# Altium schematic sheet MelansonTech Isolated Shunt Amplifier.SchDoc
size C
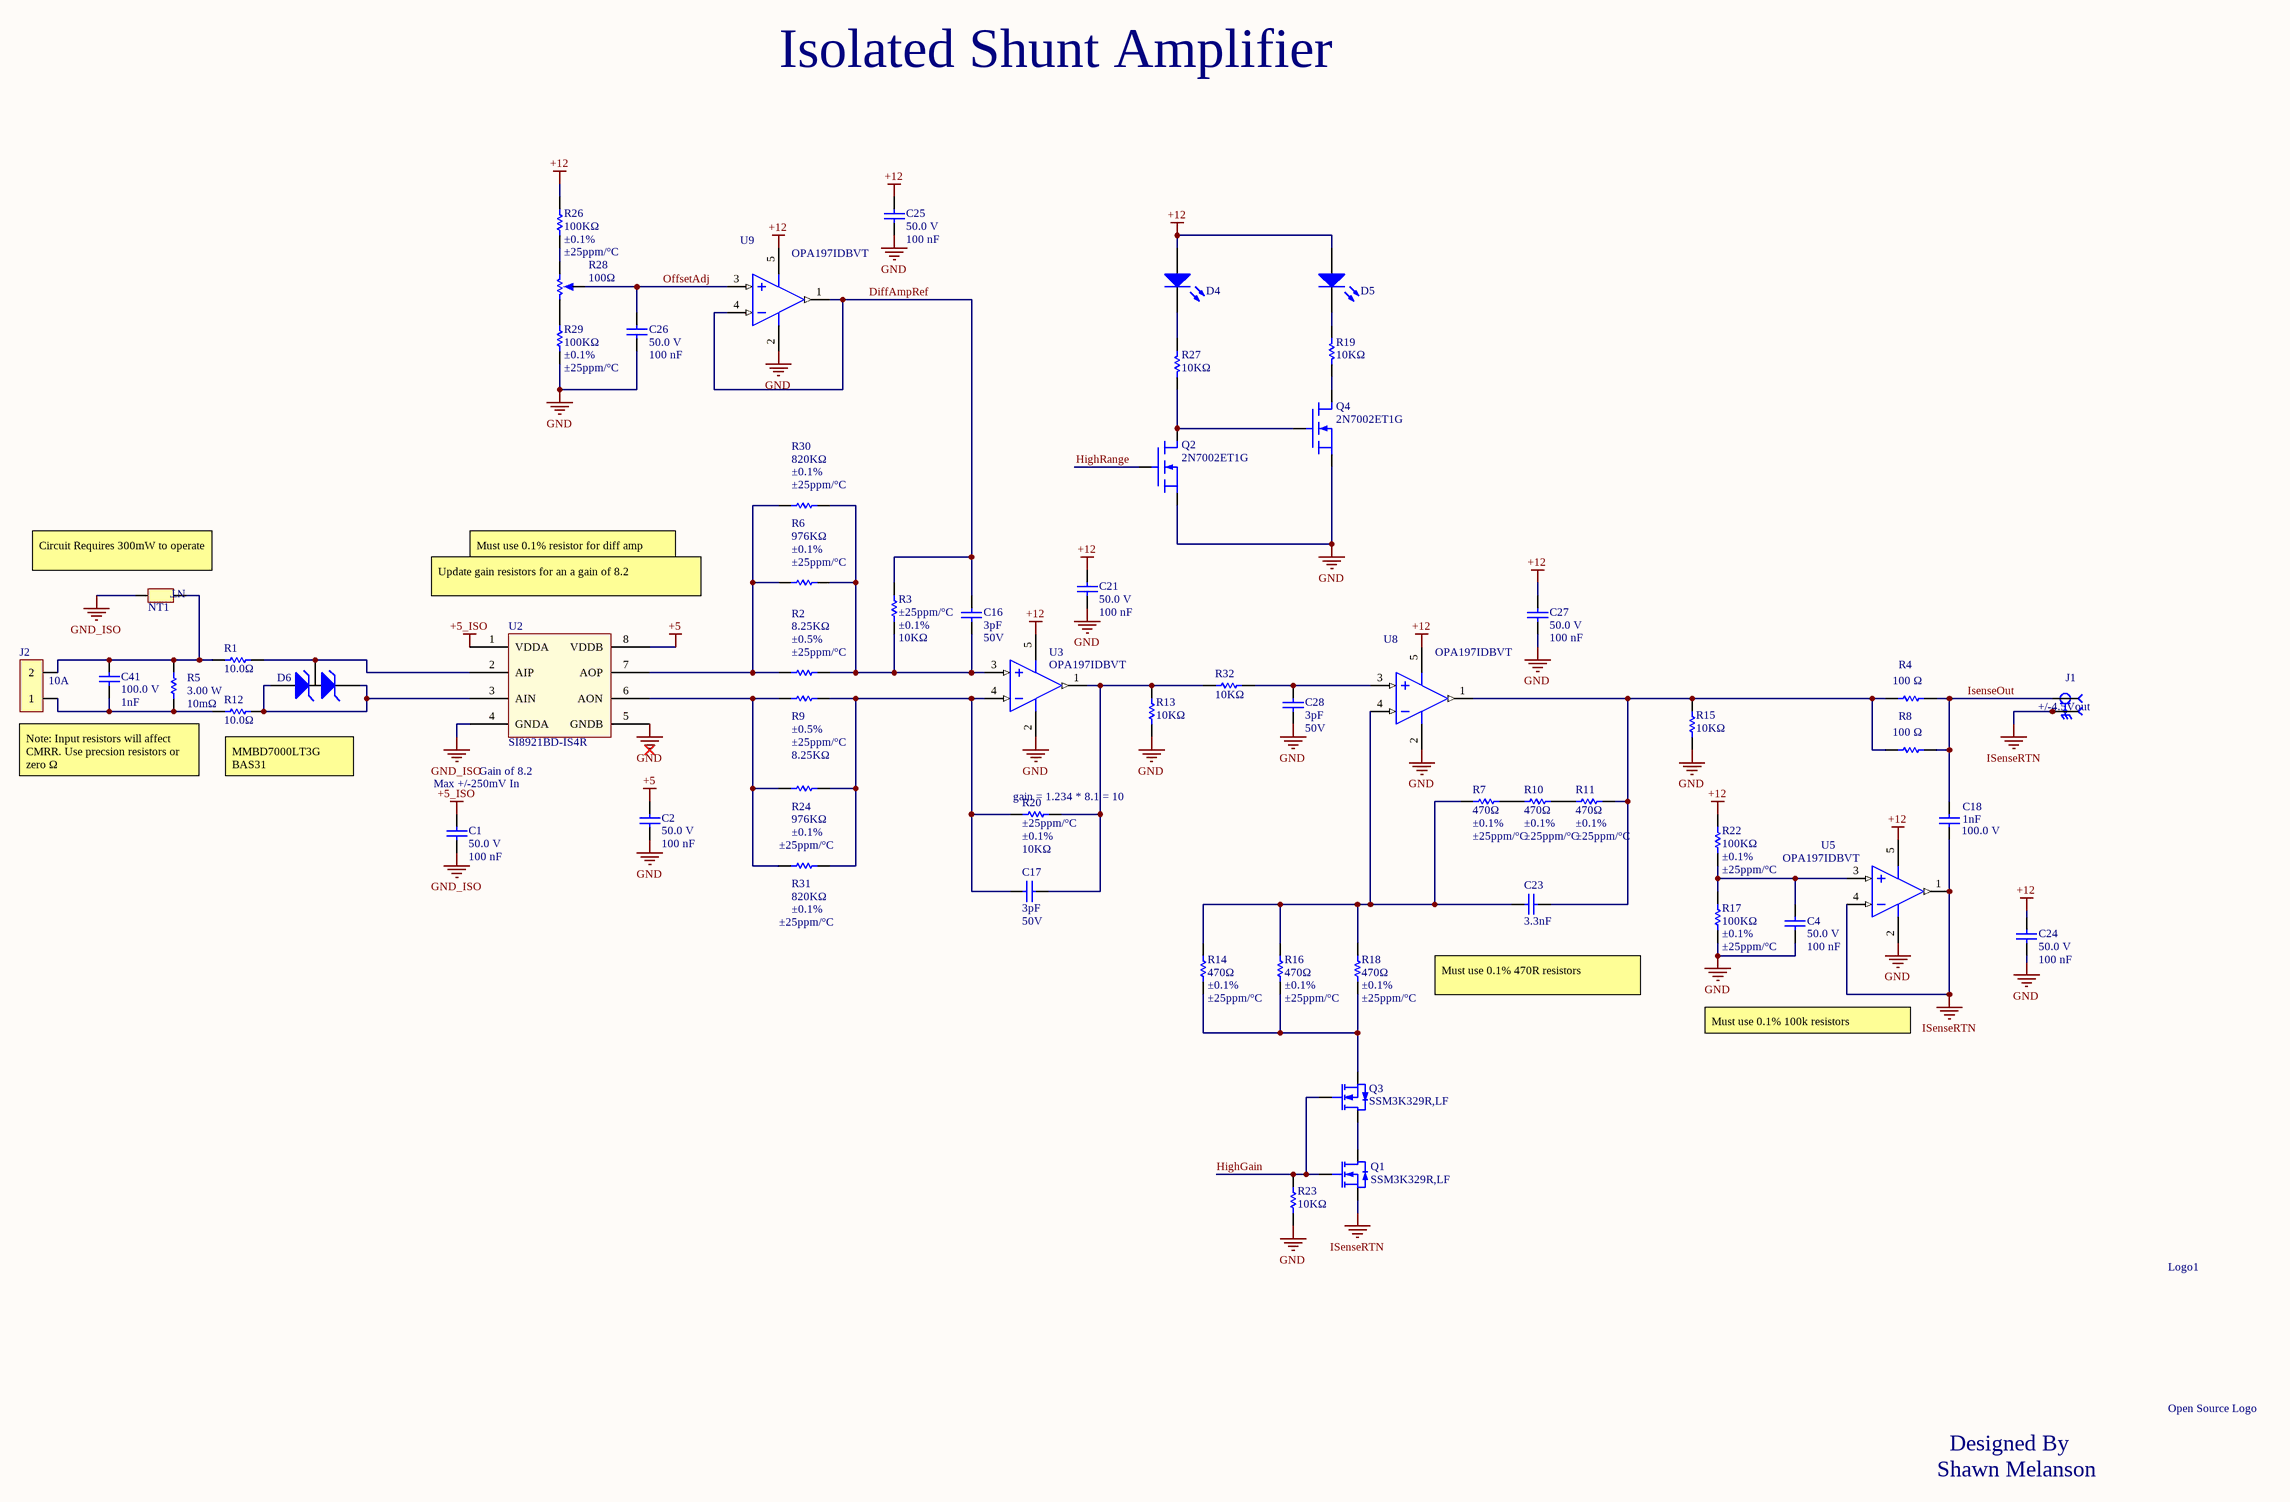
[diagram p0: MelansonTech Isolated Shunt Amplifier.SchDoc]

## Parts
C1  Voltage Rating (DC): 50.0 V  Capacitance: 100 nF  [CAP, 0805, HD]  (hidden comment: CC0805KRX7R9BB104)
C2  Voltage Rating (DC): 50.0 V  Capacitance: 100 nF  [CAP, 0805, HD]  (hidden comment: CC0805KRX7R9BB104)
C4  Voltage Rating (DC): 50.0 V  Capacitance: 100 nF  [CAP, 0805, HD]  (hidden comment: CC0805KRX7R9BB104)
C16  Capacitance: 3pF  Voltage - Rated: 50V  [CAP, 0805, HD]  (hidden comment: CC0805CRNPO9BN3R0)
C17  Capacitance: 3pF  Voltage - Rated: 50V  [CAP, 0805, HD]  (hidden comment: CC0805CRNPO9BN3R0)
C18  Voltage Rating (DC): 100.0 V  Capacitance: 1nF  [CAP, 0805, HD]  (hidden comment: C0805X102J1GACAUTO)
C21  Voltage Rating (DC): 50.0 V  Capacitance: 100 nF  [CAP, 0805, HD]  (hidden comment: CC0805KRX7R9BB104)
C23  3.3nF  [CAP, 0805, HD]
C24  Voltage Rating (DC): 50.0 V  Capacitance: 100 nF  [CAP, 0805, HD]  (hidden comment: CC0805KRX7R9BB104)
C25  Voltage Rating (DC): 50.0 V  Capacitance: 100 nF  [CAP, 0805, HD]  (hidden comment: CC0805KRX7R9BB104)
C26  Voltage Rating (DC): 50.0 V  Capacitance: 100 nF  [CAP, 0805, HD]  (hidden comment: CC0805KRX7R9BB104)
C27  Voltage Rating (DC): 50.0 V  Capacitance: 100 nF  [CAP, 0805, HD]  (hidden comment: CC0805KRX7R9BB104)
C28  Capacitance: 3pF  Voltage - Rated: 50V  [CAP, 0805, HD]  (hidden comment: CC0805CRNPO9BN3R0)
C41  Voltage Rating (DC): 100.0 V  Capacitance: 1nF  [CAP, 0805, HD]  (hidden comment: C0805X102J1GACAUTO)
D4  OVLBB4C7  [LED,TH,T1,3MM-Vert]  (value not drawn)
D5  OVLBB4C7  [LED,TH,T1,3MM-Vert]  (value not drawn)
D6  BAT54SLT1G  [SOT23-3]  (value not drawn)
J1  142-0701-801  [CINCH_142-0701-801]  (value not drawn)
J2  TE Connectivity 282836-2  [TERM BLOCK 2POS SIDE ENTRY 5MM]  (value not drawn)
Logo1  Open Source Logo  [Symbol,Open Source - No Text]
NT1  Net Tie,0.254mm  [0.254mm Net Tie]  (value not drawn)  (net tie, no BOM)
Q1  SSM3K329R,LF  [SOT23-3]
Q2  2N7002ET1G  [SOT23-3]
Q3  SSM3K329R,LF  [SOT23-3]
Q4  2N7002ET1G  [SOT23-3]
R1  Resistance: 10.0Ω  [res, 0805, HD]  (hidden comment: Vishay CRCW08051K00JNEA)
R2  Tolerance: ±0.5%  Temperature Coefficient: ±25ppm/°C  Resistance: 8.25KΩ  [res, 0805, HD]  (hidden comment: RR1220P-8251-D-M)
R3  Temperature Coefficient: ±25ppm/°C  Resistance Tolerance: ±0.1%  Resistance: 10KΩ  [res, 0805, HD]  (hidden comment: RG2012P-103-B-T5)
R4  Resistance: 100 Ω  [res, 0805, HD]  (hidden comment: CRCW0805100RJNEAC)
R5  Power Rating: 3.00 W  Resistance: 10mΩ  [Res 2512]  (hidden comment: CRA2512-FZ-R010ELF)
R6  Resistance: 976KΩ  Tolerance: ±0.1%  Temperature Coefficient: ±25ppm/°C  [res, 0805, HD]  (hidden comment: ERA-6AEB9763V)
R7  Resistance: 470Ω  Tolerance: ±0.1%  Temperature Coefficient: ±25ppm/°C  [res, 0805, HD]  (hidden comment: ERA-6AEB471V)
R8  Resistance: 100 Ω  [res, 0805, HD]  (hidden comment: CRCW0805100RJNEAC)
R9  Tolerance: ±0.5%  Temperature Coefficient: ±25ppm/°C  Resistance: 8.25KΩ  [res, 0805, HD]  (hidden comment: RR1220P-8251-D-M)
R10  Resistance: 470Ω  Tolerance: ±0.1%  Temperature Coefficient: ±25ppm/°C  [res, 0805, HD]  (hidden comment: ERA-6AEB471V)
R11  Resistance: 470Ω  Tolerance: ±0.1%  Temperature Coefficient: ±25ppm/°C  [res, 0805, HD]  (hidden comment: ERA-6AEB471V)
R12  Resistance: 10.0Ω  [res, 0805, HD]  (hidden comment: Vishay / Dale CRCW080510K0FKTA)
R13  Resistance: 10KΩ  [res, 0805, HD]  (hidden comment: Vishay / Dale CRCW080510K0FKTA)
R14  Resistance: 470Ω  Tolerance: ±0.1%  Temperature Coefficient: ±25ppm/°C  [res, 0805, HD]  (hidden comment: ERA-6AEB471V)
R15  Resistance: 10KΩ  [res, 0805, HD]  (hidden comment: Vishay / Dale CRCW080510K0FKTA)
R16  Resistance: 470Ω  Tolerance: ±0.1%  Temperature Coefficient: ±25ppm/°C  [res, 0805, HD]  (hidden comment: ERA-6AEB471V)
R17  Resistance: 100KΩ  Tolerance: ±0.1%  Temperature Coefficient: ±25ppm/°C  [res, 0805, HD]  (hidden comment: ERA-6AEB104V)
R18  Resistance: 470Ω  Tolerance: ±0.1%  Temperature Coefficient: ±25ppm/°C  [res, 0805, HD]  (hidden comment: ERA-6AEB471V)
R19  Resistance: 10KΩ  [res, 0805, HD]  (hidden comment: Vishay / Dale CRCW080510K0FKTA)
R20  Temperature Coefficient: ±25ppm/°C  Resistance Tolerance: ±0.1%  Resistance: 10KΩ  [res, 0805, HD]  (hidden comment: RG2012P-103-B-T5)
R22  Resistance: 100KΩ  Tolerance: ±0.1%  Temperature Coefficient: ±25ppm/°C  [res, 0805, HD]  (hidden comment: ERA-6AEB104V)
R23  Resistance: 10KΩ  [res, 0805, HD]  (hidden comment: Vishay / Dale CRCW080510K0FKTA)
R24  Resistance: 976KΩ  Tolerance: ±0.1%  Temperature Coefficient: ±25ppm/°C  [res, 0805, HD]  (hidden comment: ERA-6AEB9763V)
R26  Resistance: 100KΩ  Tolerance: ±0.1%  Temperature Coefficient: ±25ppm/°C  [res, 0805, HD]  (hidden comment: ERA-6AEB104V)
R27  Resistance: 10KΩ  [res, 0805, HD]  (hidden comment: Vishay / Dale CRCW080510K0FKTA)
R28  Resistance: 100Ω  [Res,SMD,POT,TC33 Series]  (hidden comment: TC33X-2-101E)
R29  Resistance: 100KΩ  Tolerance: ±0.1%  Temperature Coefficient: ±25ppm/°C  [res, 0805, HD]  (hidden comment: ERA-6AEB104V)
R30  Resistance: 820KΩ  Tolerance: ±0.1%  Temperature Coefficient: ±25ppm/°C  [res, 0805, HD]  (hidden comment: RG2012P-824-D-T5)
R31  Resistance: 820KΩ  Tolerance: ±0.1%  Temperature Coefficient: ±25ppm/°C  [res, 0805, HD]  (hidden comment: RG2012P-824-D-T5)
R32  Resistance: 10KΩ  [res, 0805, HD]  (hidden comment: CRCW080510K0FKTA)
U2  SI8921BD-IS4R  [SOIC-8 DWV]
U3  OPA197IDBVT  [SOT23-5]
U5  OPA197IDBVT  [SOT23-5]
U8  OPA197IDBVT  [SOT23-5]
U9  OPA197IDBVT  [SOT23-5]

## Nets
+5: C2.2 U2.8(VDDB)
+5_ISO: C1.2 U2.1(VDDA)
+12: C21.2 C24.2 C25.2 C27.2 D4.1(A) D5.1(A) R22.2 R26.2 U3.5(V+) U5.5(V+) U8.5(V+) U9.5(V+)
GND: C2.1 C4.1 C21.1 C24.1 C25.1 C26.1 C27.1 C28.1 Q2.2(S) Q4.2(S) R13.2 R15.1 R17.1 R23.2 R29.1 U2.5(GNDB) U3.2(V-) U5.2(V-) U8.2(V-) U9.2(V-)
GND_ISO: C1.1 NT1.2 U2.4(GNDA)
ISenseRTN: C18.1 J1.S1 J1.S2 J1.S3 J1.S4 Q1.2(S) U5.1(1OUT) U5.4(1IN-)
DiffAmpRef: C16.1 R3.1 U9.1(1OUT) U9.4(1IN-)
HighGain: Q1.1(G) Q3.1(G) R23.1
HighRange: Q2.1(G)
IsenseOut: C18.2 J1.1 R4.1 R8.1
OffsetAdj: C26.2 R28.2 U9.3(1IN+)
NetC4_2: C4.2 R17.2 R22.1 U5.3(1IN+)
NetC16_2: C16.2 R2.1 R3.2 R6.1 R30.1 U3.3(1IN+)
NetC17_1: C17.1 R13.1 R20.1 R32.2 U3.1(1OUT)
NetC17_2: C17.2 R9.1 R20.2 R24.1 R31.1 U3.4(1IN-)
NetC23_1: C23.1 R4.2 R8.2 R11.1 R15.2 U8.1(1OUT)
NetC23_2: C23.2 R7.2 R14.1 R16.1 R18.1 U8.4(1IN-)
NetC28_2: C28.2 R32.1 U8.3(1IN+)
NetC41_1: C41.1 J2.1 R5.2 R12.2
NetC41_2: C41.2 J2.2 NT1.1 R1.2 R5.1
NetD4_2: D4.2(K) R27.1
NetD5_2: D5.2(K) R19.1
NetD6_1: D6.1(A) D6.2(K) R12.1 U2.3(AIN)
NetD6_3: D6.3(AK) R1.1 U2.2(AIP)
NetQ1_3: Q1.3(D) Q3.3(D)
NetQ2_3: Q2.3(D) Q4.1(G) R27.2
NetQ3_2: Q3.2(S) R14.2 R16.2 R18.2
NetQ4_3: Q4.3(D) R19.2
NetR2_2: R2.2 R6.2 R30.2 U2.7(AOP)
NetR7_1: R7.1 R10.2
NetR9_2: R9.2 R24.2 R31.2 U2.6(AON)
NetR10_1: R10.1 R11.2
NetR26_1: R26.1 R28.3
NetR28_1: R28.1 R29.2

## Notes on the sheet
- Isolated Shunt Amplifier
- (near NT1) Circuit Requires 300mW to operate
- Update gain resistors for an a gain of 8.2
- Must use 0.1% resistor for diff amp
- 10A
- (near J1) +/-4.5Vout
- Note: Input resistors will affect CMRR. Use precsion resistors or zero Ω
- (near R12) MMBD7000LT3G
  BAS31
- Max +/-250mV In
- (near U2) Gain of 8.2
- gain = 1.234 * 8.1 = 10
- Must use 0.1% 470R resistors
- Must use 0.1% 100k resistors
- Shawn Melanson
- Designed By
- (in symbol Net Tie,0.254mm) NT

## Library data of the parts
C1 C2 C4 C21 C24-C27 = Cap,0805,100nf,50V,5%,CC0805KRX7R9BB104: CAP CER 0.1UF 50V X7R 0805; Manufacturer: YAGEO; Capacitance Tolerance: ±10%; Detailed Description: 0.1 µF ±10% 50V Ceramic Capacitor X7R 0805 (2012 Metric); Supplier 1: Digikey; Supplier Part Number 1: 311-1140-6-ND; Supplier 2: Digikey; Supplier Part Number 2: 311-1140-1-ND; Supplier 3: Mouser; Supplier Part Number 3: 603-CC805KRX7R9BB104; Supplier 4: Arrow Electronics; Supplier Part Number 4: CC0805KRX7R9BB104; Supplier 5: Digikey; Supplier Part Number 5: 311-1140-2-ND; Supplier 6: Future Electronics; Supplier Part Number 6: 2986263; Manufacturer Product Number: CC0805KRX7R9BB104; Category: Capacitors  Ceramic Capacitors; Series: CC; Part Status: Active; Temperature Coefficient: X7R; Operating Temperature: -55°C ~ 125°C; Applications: General Purpose; Mounting Type: Surface Mount, MLCC; Package / Case: 0805 (2012 Metric); Size / Dimension: 0.079" L x 0.049" W (2.00mm x 1.25mm); Thickness (Max): 0.033" (0.85mm)
C16 C17 C28 = CAP,0805,3pF,COG,NPO,CC0805CRNPO9BN3R0: CAP CER 3PF 50V C0G/NPO 0805; Manufacturer: YAGEO; Detailed Description: 3 pF ±0.25pF 50V Ceramic Capacitor C0G, NP0 0805 (2012 Metric); Tolerance: ±0.25pF; Temperature Coefficient: C0G, NP0; mfg P/N: CC0805CRNPO9BN3R0; Category: Capacitors  Ceramic Capacitors; Series: CC; Part Status: Active; Operating Temperature: -55°C ~ 125°C; Applications: General Purpose; Mounting Type: Surface Mount, MLCC; Package / Case: 0805 (2012 Metric); Size / Dimension: 0.079" L x 0.049" W (2.00mm x 1.25mm); Thickness (Max): 0.024" (0.60mm); Supplier 1: Future Electronics; Supplier Part Number 1: 9724337; Supplier 2: Arrow Electronics; Supplier Part Number 2: CC0805CRNPO9BN3R0; Supplier 3: Digikey; Supplier Part Number 3: 311-1092-1-ND; Supplier 4: Digikey; Supplier Part Number 4: 311-1092-6-ND; Supplier 5: Digikey; Supplier Part Number 5: 311-1092-2-ND; Supplier 6: Mouser; Supplier Part Number 6: 603-CC805CRNPO9BN3R0
C18 C41 = Cap,0805,1nF,±5%,100Vdc,CL10F104ZB8NNNC: CAPACITOR, 1NF, 100V, NP0, 0805; Capacitance Tolerance: ±5%; Dielectric Characteristic: C0G/NP0; Dielectric Material: Ceramic; Lead-Free Status: Lead Free; Case/Package: 0805; Mounting Style: Surface Mount; Octopart Url: https://octopart.com/c0805x102j1gacauto-kemet-23280135; Packaging: Cut Tape (CT); REACH SVHC Compliance: No SVHC; RoHS: Compliant; mfg P/N: C0805X102J1GACAUTO; Supplier 1: Digi-Key; Supplier Part Number 1: 399-19430-1-ND
C23 = CAP,0805,Generic
D4 D5 = LED,TH,T1,3mm,Blue,OVLBB4C7: Blue 470nm LED Indication - Discrete 3.2V Radial; Mfg: TT Electronics/Optek Technology; Product Status: Active; Configuration: Standard; Lens Color: Colorless; Lens Transparency: Clear; Millicandela Rating: 1800mcd; Lens Style: Round with Domed Top; Lens Size: 3mm, T-1; Current - Test: 20mA; Viewing Angle: 45°; Base Product Number: OVLBB4; Category: Optoelectronics  LED Indication - Discrete; Color: Blue; Voltage - Forward (Vf) (Typ): 3.2V; Mounting Type: Through Hole; Wavelength - Dominant: 470nm; Package / Case: Radial; Supplier Device Package: 3mm; Height (Max): 5.35mm
D6 = Diode,Shottky,Array,Series,30V,200mA,BAT54SLT1G: Diode Array 1 Pair Series Connection Schottky 30V 200mA (DC) Surface Mount TO-236-3, SC-59, SOT-23-3; Manufacturer: ON Semiconductor; Voltage - Forward (Vf) (Max) @ If: 800mV @ 100mA; Speed: Small Signal =< 200mA (Io), Any Speed; Reverse Recovery Time (trr): 5ns; Current - Reverse Leakage @ Vr: 2µA @ 25V; Detailed Description: Diode Array 1 Pair Series Connection Schottky 30V 200mA (DC) Surface Mount TO-236-3, SC-59, SOT-23-3; mfg P/N: BAT54SLT1G; Diode Type: Schottky; Diode Configuration: 1 Pair Series Connection; Voltage - DC Reverse (Vr) (Max): 30V; Current - Average Rectified (Io) (per Diode): 200mA (DC); Operating Temperature - Junction: 125°C (Max); Mounting Type: Surface Mount; Package / Case: TO-236-3, SC-59, SOT-23-3; Supplier Device Package: SOT-23-3 (TO-236); Base Part Number: BAT54SL; Supplier 1: Digi-Key; Supplier Part Number 1: BAT54SLT1GOSCT-ND; Supplier 2: LCSC; Supplier Part Number 2: C19726
J1 = Conn,SMA,Female,End Launch,142-0701-801: CONN SMA JACK STR 50OHM EDGE MNT; Manufacturer: Cinch Connectivity Solutions Johnson; Detailed Description: SMA Connector Jack, Female Socket 50Ohm Board Edge, End Launch Solder; Connector: Style   SMA; Connector Type: Jack, Female Socket; Contact Termination: Solder; Body Material: Brass; Body Finish: Gold; Dielectric Material: Polytetrafluoroethylene (PTFE); Center Contact Material: Beryllium Copper; Mating Cycles: 500; Number of Ports: 1; Frequency - Max: 18GHz; Voltage Rating: 335V; mfg P/N: 142-0701-801; Category: Connectors, Interconnects  Coaxial Connectors (RF); Part Status: Active; Shield Termination: Solder; Impedance: 50Ohm; Mounting Type: Board Edge, End Launch; Fastening Type: Threaded; Housing Color: Gold; Center Contact Plating: Gold; Operating Temperature: -65°C ~ 165°C; Supplier 1: Digi-Key; Supplier Part Number 1: J502-ND
J2 = TERM BLOCK 2POS SIDE ENTRY 5MM, 282836-2: Wire to Board 2 Position 5 mm Pitch 30-16 AWG Euro Style Terminal Block; Voltage Rating (AC): 250.0 V; ELV Compliant: Compliant; Current Rating: 13.5 A; Number of Contacts: 2; Pin Pitch: 0.005 m; Lead-Free Status: Lead Free; Wire Gauge: 15.0 AWG; RoHS: Compliant; Contact Material: Brass; Contact Plating: Tin; Color: Green; Manufacturer Part Number: 282836-2; Flammability Rating: UL 94 V-0; Mounting Style: PCB; Housing Material: Nylon 6/6; Insulation Material: Nylon; Housing Color: Green; Orientation: Right Angle; Lifecycle Status: Active; REACH SVHC Compliance: No SVHC; Number of Positions: 2; Supplier 1: TME; Supplier 2: Newark; Supplier 3: Digi-Key; Supplier 4: Digi-Key; Supplier Part Number 4: A98076-ND
Logo1 = Symbol,Open Source: Open Source Silk Screen Logo
Q1 Q3 = MOSFET.N-Chan, SOT-23-3,3.5A,30V,1W,SSM3K329R,LF: N-Channel 30V 3.5A (Ta) 1W (Ta) Surface Mount SOT-23F; Lead-Free Status: Lead Free; Drain to Source Voltage (Vdss): 30Vdc; Technology MOSFET: (Metal Oxide); Drive Voltage (Max Rds On, Min Rds On): 1.8V, 4V; Rds On (Max) @ Id, Vgs: 126 mOhm @ 1A, 4V; Vgs(th) (Max) @ Id: 1V @ 1mA; Gate Charge (Qg) (Max) @ Vgs: 1.5nC @ 4V; Vgs (Max): ±12V; Input Capacitance (Ciss) (Max) @ Vds: 123pF @ 15V; RoHS: Compliant; REACH SVHC Compliance: No SVHC; Mounting Style: Surface Mount; Lifecycle Status: Active; Current - Continuous Drain (Id) @ 25°C: 3.5A; Power Dissipation (Max): 1W; FET Type: N-Channel; Operating Temperature: 150°C (TJ); Mounting Type: Surface Mount; Supplier Device Package: SOT-23F; Package / Case: SOT-23-3  Flat Leads; mfg P/N: SSM3K329R,LF; Supplier 1: Digi-Key; Supplier Part Number 1: SSM3K329RLFDKR-ND
Q2 Q4 = MOSFET,N-Channel,SOT23,0.25A,60V,2N7002ET1G: Small Signal MOSFET, 60 V, 310 mA, Single, N-Channel, 3-Pin SOT-23, Pb-Free, Tape and Reel; Manufacturer: ON Semiconductor; Continuous Drain Current (Ids): 0.25A; Lead-Free Status: Lead Free; Drain to Source Voltage (Vds): 60.0 V; Power Dissipation (Max): 350mW (Ta); REACH SVHC Compliance: No SVHC; Number of Pins: 3; Halogen Free Status: Halogen Free; Case/Package: SOT-23-3; Polarity: N-Channel; RoHS: Compliant; Lifecycle Status: Active; Supplier 1: Digi-Key; Supplier Part Number 1: 2N7002ET1GOSCT-ND; Supplier 2: LCSC; Supplier Part Number 2: C71533; Manufacturer Part Number: 2N7002ET1G
R1 R12 = Res,0805,10.0Ω,5%,±200ppm/°C,RMCF0805JT10R0: RES 10 OHM 5% 1/8W 0805; Manufacturer: Stackpole Electronics Inc; Detailed Description: 10 Ohms ±5% 0.125W, 1/8W Chip Resistor 0805 (2012 Metric) Automotive AEC-Q200 Thick Film; Categories: Resistors   Chip Resistor - Surface Mount; Power (Watts): 0.125W, 1/8W; mfg P/N: RMCF0805JT10R0; Part Status: Active; Series: RMCF; Tolerance: ±5%; Composition: Thick Film; Features: Automotive AEC-Q200; Temperature Coefficient: ±200ppm/°C; Operating Temperature: -55°C ~ 155°C; Package / Case: 0805 (2012 Metric); Ratings: AEC-Q200; Supplier Device Package: 0805; Supplier 1: Digi-Key; Supplier Part Number 1: RMCF0805JT10R0CT-ND
R2 R9 = Res,0805,8.25KΩ,0.5%,±25ppm/°C,RR1220P-8251-D-M: RES SMD 8.25KOHM 0.5% 1/10W 0805; Manufacturer: Susumu; Detailed Description: 8.25 kOhms ±0.5% 0.1W, 1/10W Chip Resistor 0805 (2012 Metric) Thin Film; Power (Watts): 0.1W, 1/10W; mfg P/N: RR1220P-8251-D-M; Category: Resistors  Chip Resistor - Surface Mount; Mfr: Susumu; Series: RR; Part Status: Active; Composition: Thin Film; Operating Temperature: -55°C ~ 125°C; Package / Case: 0805 (2012 Metric); Size / Dimension: 0.079"" L x 0.049"" W (2.00mm x 1.25mm); Height - Seated (Max): 0.020"" (0.50mm); Number of Terminations: 2; Supplier 1: Mouser; Supplier Part Number 1: 754-RR1220P-8251D-M; Supplier 2: Digikey; Supplier Part Number 2: RR12P8.25KDCT-ND; Supplier 3: Digikey; Supplier Part Number 3: RR12P8.25KDDKR-ND; Supplier 4: Future Electronics; Supplier Part Number 4: 3847365; Supplier 5: Digikey; Supplier Part Number 5: RR12P8.25KDTR-ND
R3 R20 = Res,0805,10.0kΩ,0.1%,±25ppm/°C,RG2012P-103-B-T5: RES SMD 10K OHM 0.1% 1/8W 0805; Mfr: Susumu; Lead-Free Status: Contains Lead; Voltage Rating (DC): 150.0 V; Detailed Description: 10 kOhms ±0.1% 0.125W, 1/8W Chip Resistor 0805 (2012 Metric) Anti-Sulfur, Automotive AEC-Q200 Thin Film; Power (Watts): 0.125W, 1/8W; Number of Pins: 2; Mounting Style: Surface Mount; mfg P/N: RG2012P-103-B-T5; Category: Resistors  Chip Resistor - Surface Mount; Series: RG; Part Status: Active; Features: Anti-Sulfur, Automotive AEC-Q200; Operating Temperature: -55°C ~ 155°C; Package / Case: 0805 (2012 Metric); Supplier Device Package: 0805; Ratings: AEC-Q200; Size / Dimension: 0.079" L x 0.049" W (2.00mm x 1.25mm); Height - Seated (Max): 0.020" (0.50mm); Number of Terminations: 2; Supplier 1: Future Electronics; Supplier Part Number 1: 4000243; Supplier 2: Mouser; Supplier Part Number 2: 754-RG2012P-103-B-T5; Supplier 3: Digikey; Supplier Part Number 3: RG20P10.0KBCT-ND; Supplier 4: Digikey; Supplier Part Number 4: RG20P10.0KBDKR-ND; Supplier 5: Digikey; Supplier Part Number 5: RG20P10.0KBTR-ND
R4 R8 = Res,0805,100Ω,5%,±200ppm/°C: RES 100 OHM 5% 1/8W 0805; Lead-Free Status: Lead Free; Power Rating: 0.125 W; Detailed Description: 100 Ohms ±5% 0.125W, 1/8W Chip Resistor 0805 (2012 Metric) Thick Film; Case/Package: 0805 (2012 Metric); Number of Pins: 2; RoHS: Compliant; mfg P/N: CRCW0805100RJNEAC; Tolerance: ±5%; Temperature Coefficient: ±200ppm/°C; Operating Temperature: -55°C ~ 155°C; Supplier 1: Digi-Key; Supplier Part Number 1: 541-100ACT-ND; Supplier 2: Mouser; Supplier Part Number 2: 71-CRCW0805100RJNEAC; Supplier 3: Arrow Electronics; Supplier Part Number 3: CRCW0805100RJNEAC; Supplier 4: Digikey; Supplier Part Number 4: 541-4166-1-ND; Supplier 5: Digikey; Supplier Part Number 5: 541-4166-6-ND; Supplier 6: Mouser; Supplier Part Number 6: 71-CRCW0805100RJNEA; Supplier 7: Digikey; Supplier Part Number 7: 541-100ACT-ND; Supplier 8: Digikey; Supplier Part Number 8: 541-100ADKR-ND; Supplier 9: Future Electronics; Supplier Part Number 9: 7083546
R5 = Res,2512,10mΩ,3.00W,±1%,CRA2512-FZ-R010ELF: Resistor; Metal Film; Res 0.01 Ohms; Pwr-Rtg 3 W; Tol 1%; SMT; 2512; Current Sense; Case/Package (SI): 2512; Resistance Tolerance: ±1%; Octopart URL: http://octopart.com/cra2512-fz-r010elf-bourns-7483589; Manufacturer Part Number: CRA2512-FZ-R010ELF; Packaging: Tape & Reel (TR), Cut Tape (CT); REACH SVHC Compliance: No SVHC; RoHS: Compliant; Number of Pins: 2; Mounting Style: Surface Mount; Case/Package: 1005; Supplier 1: Arrow Electronics; Supplier Part Number 1: CRA2512-FZ-R010ELF; Supplier 2: Digikey; Supplier Part Number 2: CRA2512-FZ-R010ELFCT-ND; Supplier 3: Mouser; Supplier Part Number 3: 652-CRA2512FZR010ELF
R6 R24 = Res,0805,976KΩ,±0.1%,±25ppm/°C,ERA-6AEB9763V: RES SMD 976K OHM 0.1% 1/8W 0805; Manufacturer: Panasonic Electronic Components; Detailed Description: 976 kOhms ±0.1% 0.125W, 1/8W Chip Resistor 0805 (2012 Metric) Automotive AEC-Q200 Thin Film; Power (Watts): 0.125W, 1/8W; Features  Automotive: AEC-Q200; mfg P/N: ERA-6AEB9763V; Category: Resistors  Chip Resistor - Surface Mount; Mfr: Panasonic Electronic Components; Series: ERA-6A; Part Status: Active; Composition: Thin Film; Operating Temperature: -55°C ~ 155°C; Package / Case: 0805 (2012 Metric); Supplier Device Package: 0805; Ratings: AEC-Q200; Size / Dimension: 0.079" L x 0.049" W (2.00mm x 1.25mm); Height - Seated (Max): 0.024" (0.60mm); Number of Terminations: 2; Base Product Number: ERA-6AEB; Supplier 1: Mouser; Supplier Part Number 1: 667-ERA-6AEB9763V; Supplier 2: Future Electronics; Supplier Part Number 2: 9105847; Supplier 3: Digikey; Supplier Part Number 3: P976KDACT-ND; Supplier 4: Digikey; Supplier Part Number 4: P976KDADKR-ND; Supplier 5: Future Electronics; Supplier Part Number 5: 5032934; Supplier 6: Digikey; Supplier Part Number 6: P976KDATR-ND
R7 R10 R11 R14 R16 R18 = Res,0805,470Ω,±0.1%,±25ppm/°C,ERA-6AEB471V: RES SMD 470 OHM 0.1% 1/8W 0805; Manufacturer: Panasonic Electronic Components; Detailed Description: 470 Ohms ±0.1% 0.125W, 1/8W Chip Resistor 0805 (2012 Metric) Automotive AEC-Q200 Thin Film; Power (Watts): 0.125W, 1/8W; Features  Automotive: AEC-Q200; mfg P/N: ERA-6AEB471V; Category: Resistors  Chip Resistor - Surface Mount; Mfr: Panasonic Electronic Components; Series: ERA-6A; Part Status: Active; Composition: Thin Film; Operating Temperature: -55°C ~ 155°C; Package / Case: 0805 (2012 Metric); Supplier Device Package: 0805; Ratings: AEC-Q200; Size / Dimension: 0.079" L x 0.049" W (2.00mm x 1.25mm); Height - Seated (Max): 0.024" (0.60mm); Number of Terminations: 2; Base Product Number: ERA-6AEB
R13 R15 R19 R23 R27 R32 = Res,0805,10.0kΩ,1%,100 ppm,CRCW080510K0FKTA: RES SMD 10K OHM 1% 1/8W 0805; Temperature Coefficient: 100.0 ppm/C; Lead-Free Status: Contains Lead; Voltage Rating (DC): 150.0 V; Power Rating: 0.125 W; Case/Package (SI): 2012; Size-Width: 0.00125 m; Resistance Tolerance: 1%; Size-Length: 0.002 m; RoHS: Non-Compliant; Power Dissipation: 0.125 W; Number of Pins: 2; REACH SVHC Compliance: No SVHC; Size-Height: 0.00045 m; Case/Package: 0805; Mounting Style: Surface Mount; Supplier 1: Digi-Key; Supplier Part Number 1: 541-3016-1-ND
  R32: Supplier 2: Mouser; Supplier Part Number 2: 71-CRCW0805-10K; Supplier 3: Digikey; Supplier Part Number 3: 541-3016-6-ND; Supplier 4: Digikey; Supplier Part Number 4: 541-3016-1-ND; Supplier 5: Arrow Electronics; Supplier Part Number 5: CRCW080510K0FKTA
R17 R22 R26 R29 = Res,0805,100K,±0.1%,±25ppm/°C,ERA-6AEB104V: RES SMD 100K OHM 0.1% 1/8W 0805; Manufacturer: Panasonic Electronic Components; Detailed Description: 100 kOhms ±0.1% 0.125W, 1/8W Chip Resistor 0805 (2012 Metric) Automotive AEC-Q200 Thin Film; Power (Watts): 0.125W, 1/8W; Features  Automotive: AEC-Q200; mfg P/N: ERA-6AEB104V; Category: Resistors  Chip Resistor - Surface Mount; Mfr: Panasonic Electronic Components; Series: ERA-6A; Part Status: Active; Composition: Thin Film; Operating Temperature: -55°C ~ 155°C; Package / Case: 0805 (2012 Metric); Supplier Device Package: 0805; Ratings: AEC-Q200; Size / Dimension: 0.079" L x 0.049" W (2.00mm x 1.25mm); Height - Seated (Max): 0.024" (0.60mm); Number of Terminations: 2; Base Product Number: ERA-6AEB; Supplier 1: Mouser; Supplier Part Number 1: 667-ERA-6AEB104V; Supplier 2: Future Electronics; Supplier Part Number 2: 3098727; Supplier 3: Digikey; Supplier Part Number 3: P100KDACT-ND
R28 = Res,POT,SMD,100Ω,0.1W, TC33X-2-101E: TRIMMER 100 OHM 0.1W J LEAD TOP; Manufacturer: Bourns Inc.; Detailed Description: 100 Ohms 0.1W, 1/10W J Lead Surface Mount Trimmer Potentiometer Cermet 1 Turn Top Adjustment; Power (Watts): 0.1W, 1/10W; Tolerance: ±25%; Temperature Coefficient: ±250ppm/°C; Adjustment Type: Top Adjustment; Resistive Material: Cermet; Number of Turns: 1; mfg P/N: TC33X-2-101E; Datasheets: TC33 Series; Category: Potentiometers, Variable Resistors  Trimmer Potentiometers; Series: Trimpot® TC33 - Open Frame; Part Status: Active; Mounting Type: Surface Mount; Termination Style: J Lead; Size / Dimension: Rectangular - 0.150"" x 0.142"" Face x 0.047"" H (3.80mm x 3.60mm x 1.20mm); Supplier 1: Digi-Key; Supplier 2: Digi-Key; Supplier Part Number 2: TC33X-101EDKR-ND
R30 R31 = Res,0805,820KΩ,±0.1%,±25ppm/°C,RG2012P-824-D-T5: RES SMD 820K OHM 0.5% 1/8W 0805; Manufacturer: Susumu; Detailed Description: 820 kOhms ±0.5% 0.125W, 1/8W Chip Resistor 0805 (2012 Metric) Anti-Sulfur, Automotive AEC-Q200 Thin Film; Power (Watts): 0.125W, 1/8W; Features  Automotive: AEC-Q200; Base Product Number: ERA-6AEB; mfg P/N: RG2012P-824-D-T5; Category: Resistors  Chip Resistor - Surface Mount; Mfr: Susumu; Series: RG; Part Status: Active; Composition: Thin Film; Operating Temperature: -55°C ~ 155°C; Package / Case: 0805 (2012 Metric); Supplier Device Package: 0805; Ratings: AEC-Q200; Size / Dimension: 0.079" L x 0.049" W (2.00mm x 1.25mm); Height - Seated (Max): 0.024" (0.60mm); Number of Terminations: 2; Supplier 1: Digikey; Supplier Part Number 1: 408-RG2012P-824-D-T5CT-ND; Supplier 2: Digikey; Supplier Part Number 2: 408-RG2012P-824-D-T5TR-ND; Supplier 3: Digikey; Supplier Part Number 3: 408-RG2012P-824-D-T5DKR-ND; Supplier 4: Mouser; Supplier Part Number 4: 754-RG2012P-824DT5
U2 = IC,CurrentSense,Isolated,8.2 Gain,500Khz,SI8921BD-IS4R: Isolation IC Inverters, Power Supplies, UPS 8-SOIC; Mfr: Skyworks Solutions Inc.; Base Product Number: SI8921; Detailed Description: Isolation IC Inverters, Power Supplies, UPS 8-SOIC; Category: Integrated Circuits (ICs)  Linear  Amplifiers  Special Purpose Amplifiers; Part Status: Active; Type: Isolation; Applications: Automotive, Inverters, Power Supplies, UPS; Mounting Type: Surface Mount; Package / Case: 8-SOIC (0.295", 7.50mm Width); Supplier Device Package: 8-SOIC; Supplier 1: Digikey; Supplier Part Number 1: 863-SI8921BD-IS4RCT-ND; Supplier 2: Digikey; Supplier Part Number 2: 863-SI8921BD-IS4RDKR-ND; Supplier 3: Digikey; Supplier Part Number 3: 863-SI8921BD-IS4RTR-ND; Supplier 4: Mouser; Supplier Part Number 4: 634-SI8921BDIS4
U3 U5 U8 U9 = OPAMP, single, General Purpose,Rail-to-Rail,10MHz,SOT-23-5,OPA197IDBVT: General Purpose Amplifier 1 Circuit Rail-to-Rail SOT-23-5; Manufacturer: Texas Instruments; Supply Current: 1mA; Number of Channels: 1; Slew Rate: 20V/μs; Gain Bandwidth Product: 10MHz; Voltage - Input Offset: 25uV; Current - Output / Channel: 65mA; Current - Input Bias: 5pA; Voltage - Supply, Single/Dual (±): 4.5 V ~ 36 V, ±2.25 V ~ 18 V; REACH SVHC Compliance: No SVHC; Operating Temperature: -40°C ~ 125°C; Supplier Device Package: SOT-23-5; Supplier 1: LCSC; Supplier Part Number 1: C131929; Supplier 2: Digi-Key; Supplier Part Number 2: 296-44076-6-ND; Mfg P/N: OPA197IDBVT